# Altium schematic sheet AT86RF.SchDoc
size A3; DocumentNumber: 7; Revision: B; SheetNumber: 7; SheetTotal: 7; SheetTitle: Modem and TCXO; Designer: DM; Reviewer: -
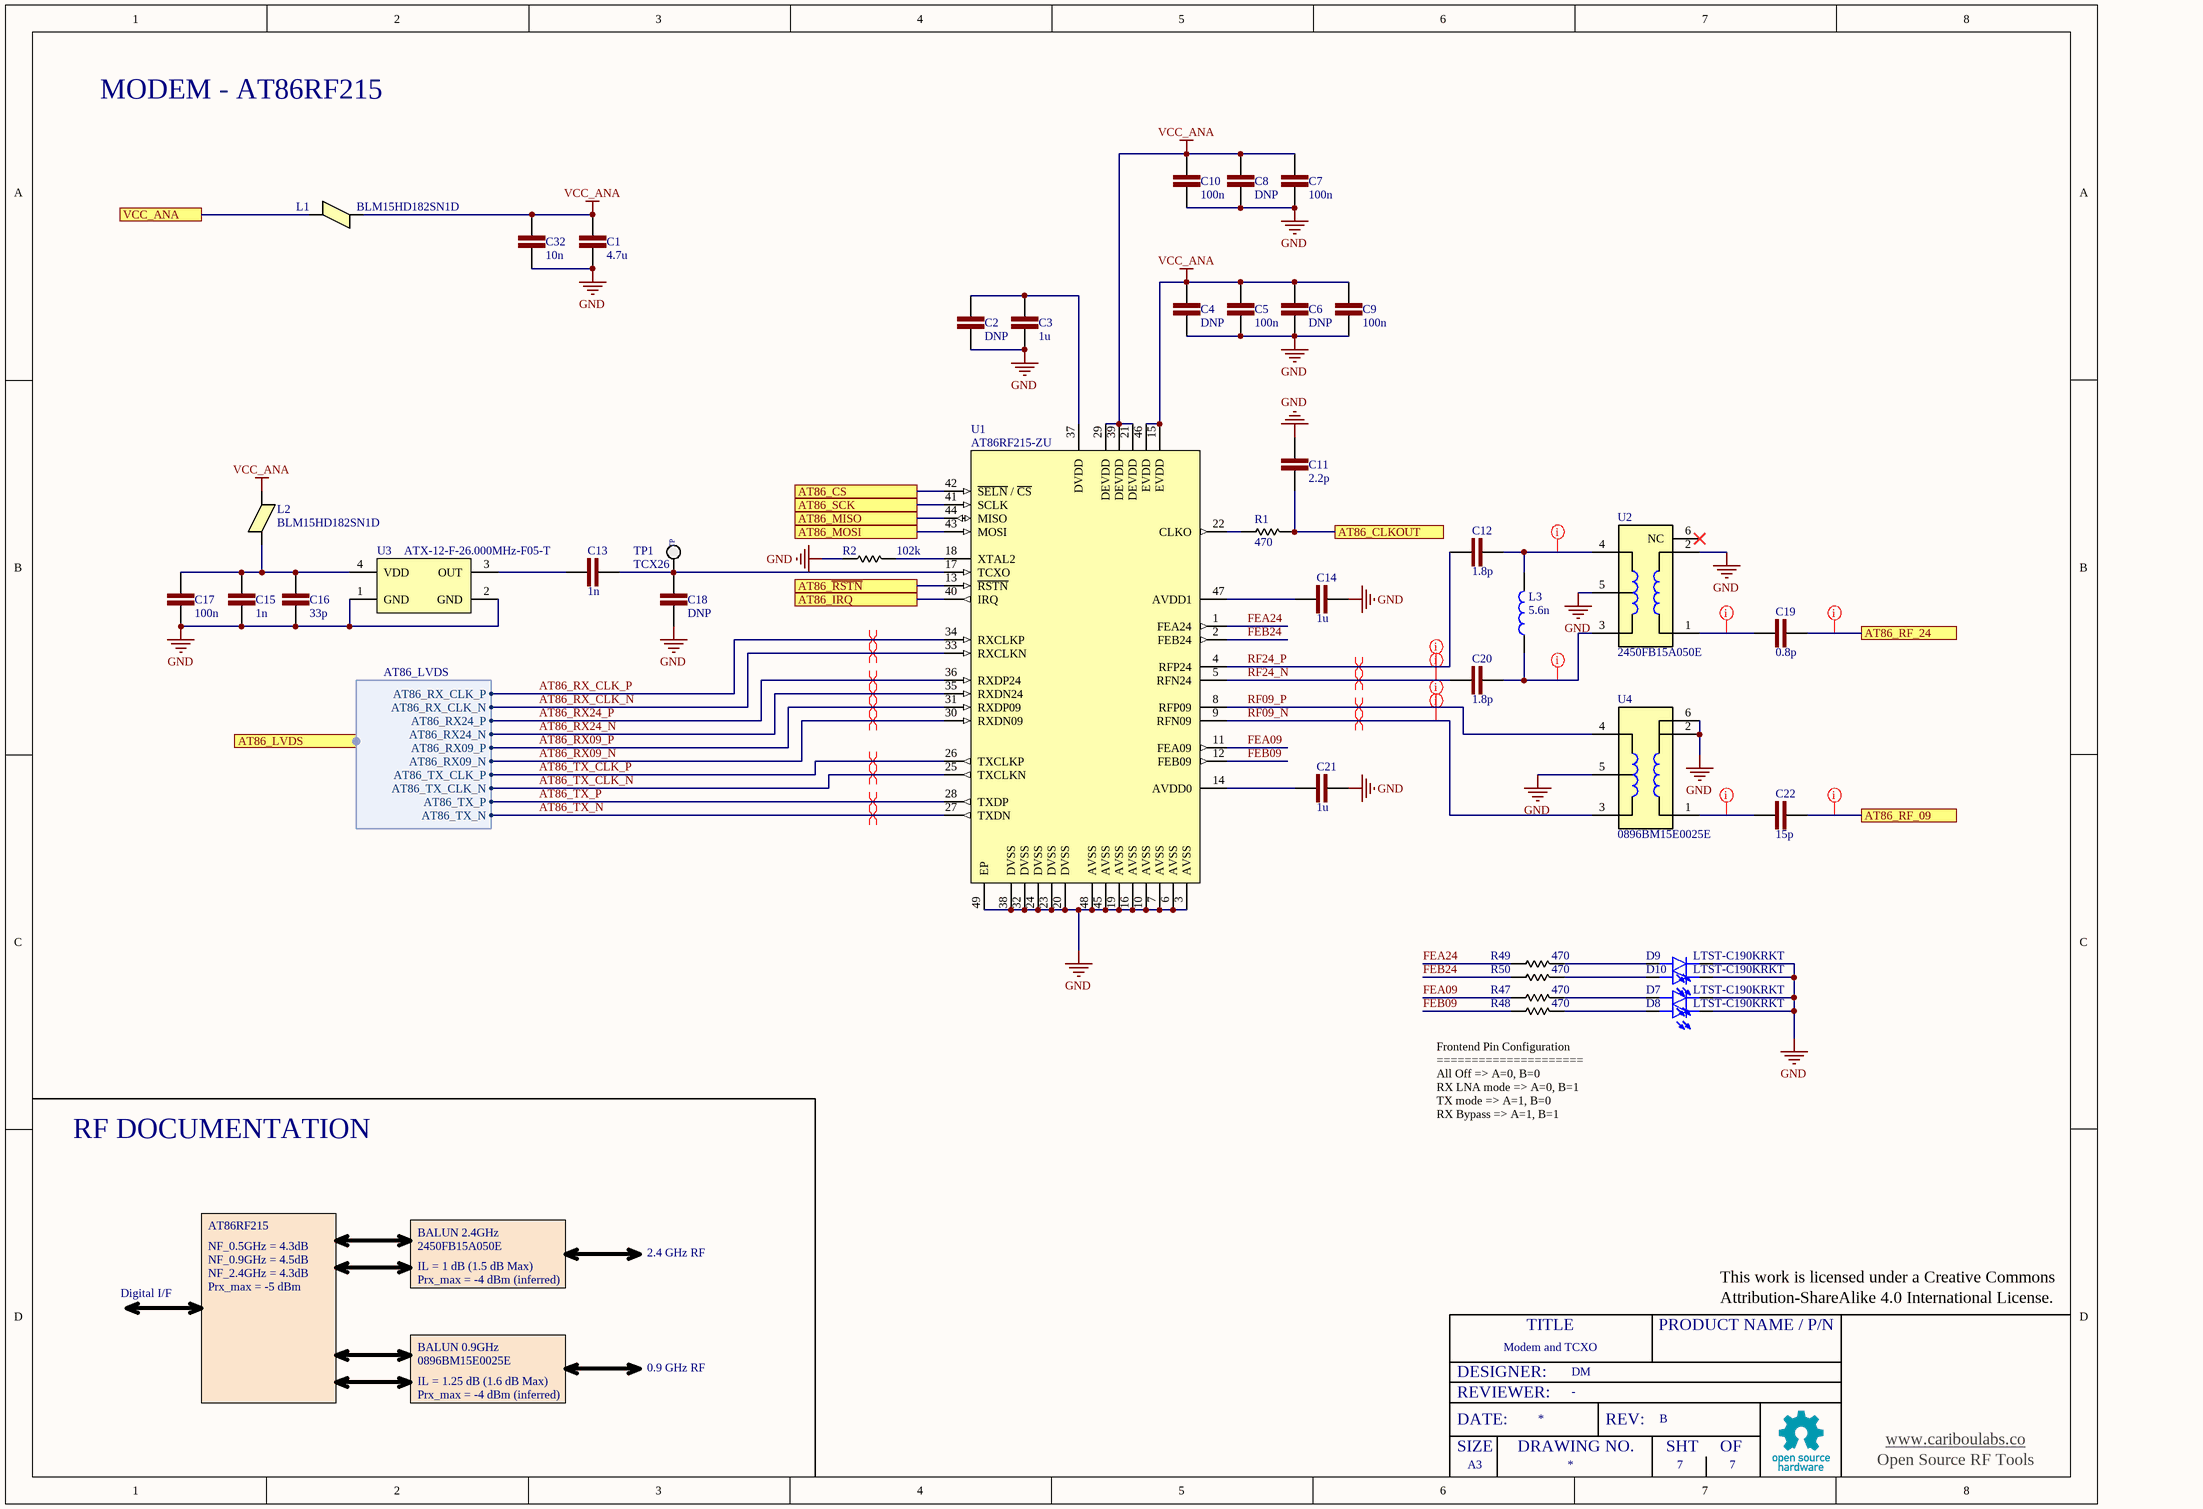
[diagram p0: AT86RF.SchDoc]

## Parts
C1  4.7u  [MURATA 0402]
C2  DNP  [MURATA 0402]
C3  1u  [MURATA 0402]
C4  DNP  [MURATA 0402]
C5  100n  [MURATA 0402]
C6  DNP  [MURATA 0402]
C7  100n  [MURATA 0402]
C8  DNP  [MURATA 0402]
C9  100n  [MURATA 0402]
C10  100n  [MURATA 0402]
C11  2.2p  [MURATA 0402]
C12  1.8p  [MURATA 0402]
C13  1n  [MURATA 0402]
C14  1u  [MURATA 0402]
C15  1n  [MURATA 0402]
C16  33p  [MURATA 0402]
C17  100n  [MURATA 0402]
C18  DNP  [MURATA 0402]
C19  0.8p  [MURATA 0402]
C20  1.8p  [MURATA 0402]
C21  1u  [MURATA 0402]
C22  15p  [MURATA 0402]
C32  10n  [MURATA 0402]
D7  LTST-C190KRKT  [LEDC1608X35N]
D8  LTST-C190KRKT  [LEDC1608X35N]
D9  LTST-C190KRKT  [LEDC1608X35N]
D10  LTST-C190KRKT  [LEDC1608X35N]
L1  BLM15HD182SN1D  [0402 FERRITE BEAD]
L2  BLM15HD182SN1D  [0402 FERRITE BEAD]
L3  5.6n  [CoilCraft 0402]
R1  470  [PANASONIC 0402]
R2  102k  [PANASONIC 0402]
R47  470  [PANASONIC 0402]
R48  470  [PANASONIC 0402]
R49  470  [PANASONIC 0402]
R50  470  [PANASONIC 0402]
TP1  TCX26  [TP_40]
U1  AT86RF215-ZU  [QFN50P700X700X90-49N-D]
U2  2450FB15A050E  [FIL_0896BM15E0025E]
U3  ATX-12-F-26.000MHz-F05-T  [TCXO_4_25x20]
U4  0896BM15E0025E  [FIL_0896BM15E0025E]

## Ports
AT86_CLKOUT, AT86_CS, AT86_IRQ, AT86_LVDS (harness AT86_LVDS), AT86_MISO, AT86_MOSI, AT86_RF_09, AT86_RF_24, AT86_SCK, AT86_~{RSTN}, VCC_ANA

## Harnesses
AT86_LVDS: AT86_RX_CLK_P, AT86_RX_CLK_N, AT86_RX24_P, AT86_RX24_N, AT86_RX09_P, AT86_RX09_N, AT86_TX_CLK_P, AT86_TX_CLK_N, AT86_TX_P, AT86_TX_N

## Nets
GND: C1.2 C2.1 C3.2 C4.1 C5.1 C6.1 C7.1 C8.1 C9.1 C10.1 C11.1 C14.1 C15.1 C16.1 C17.1 C18.1 C21.1 C32.2 D7.C D8.C D9.C D10.C R2.1 U1.3(AVSS) U1.6(AVSS) U1.7(AVSS) U1.10(AVSS) U1.16(AVSS) U1.19(AVSS) U1.20(DVSS) U1.23(DVSS) U1.24(DVSS) U1.32(DVSS) U1.38(DVSS) U1.45(AVSS) U1.48(AVSS) U1.49(EP) U2.2(GND) U2.5(GND) U3.1(GND) U3.2(GND) U4.2(GND) U4.5(GND) U4.6(GND)
VCC_ANA: C1.1 C4.2 C5.2 C6.2 C7.2 C8.2 C9.2 C10.2 C32.1 L1.2 L2.2 U1.15(EVDD) U1.21(DEVDD) U1.29(DEVDD) U1.39(DEVDD) U1.46(EVDD)
AT86_CLKOUT: C11.2 R1.2 ; port AT86_CLKOUT
AT86_CS: U1.42(~{SELN}_/_~{CS}) ; port AT86_CS
AT86_IRQ: U1.40(IRQ) ; port AT86_IRQ
AT86_MISO: U1.44(MISO) ; port AT86_MISO
AT86_MOSI: U1.43(MOSI) ; port AT86_MOSI
AT86_~{RSTN}: U1.13(~{RSTN}) ; port AT86_~{RSTN}
AT86_RF_09: C22.1 ; port AT86_RF_09
AT86_RF_24: C19.1 ; port AT86_RF_24
AT86_RX09_N: U1.30(RXDN09) ; port AT86_LVDS.AT86_RX09_N
AT86_RX09_P: U1.31(RXDP09) ; port AT86_LVDS.AT86_RX09_P
AT86_RX24_N: U1.35(RXDN24) ; port AT86_LVDS.AT86_RX24_N
AT86_RX24_P: U1.36(RXDP24) ; port AT86_LVDS.AT86_RX24_P
AT86_RX_CLK_N: U1.33(RXCLKN) ; port AT86_LVDS.AT86_RX_CLK_N
AT86_RX_CLK_P: U1.34(RXCLKP) ; port AT86_LVDS.AT86_RX_CLK_P
AT86_SCK: U1.41(SCLK) ; port AT86_SCK
AT86_TX_CLK_N: U1.25(TXCLKN) ; port AT86_LVDS.AT86_TX_CLK_N
AT86_TX_CLK_P: U1.26(TXCLKP) ; port AT86_LVDS.AT86_TX_CLK_P
AT86_TX_N: U1.27(TXDN) ; port AT86_LVDS.AT86_TX_N
AT86_TX_P: U1.28(TXDP) ; port AT86_LVDS.AT86_TX_P
FEA09: R47.1 U1.11(FEA09)
FEA24: R49.1 U1.1(FEA24)
FEB09: R48.1 U1.12(FEB09)
FEB24: R50.1 U1.2(FEB24)
RF09_N: U1.9(RFN09) U4.3(B1)
RF09_P: U1.8(RFP09) U4.4(B2)
RF24_N: C20.2 U1.5(RFN24)
RF24_P: C12.2 U1.4(RFP24)
VCC_ANA: L1.1 ; port VCC_ANA  [a separate net that carries the same name]
NetC2_2: C2.2 C3.1 U1.37(DVDD)
NetC12_1: C12.1 L3.2 U2.4(B2)
NetC13_1: C13.1 C18.2 TP1.1(TP) U1.17(TCXO)
NetC13_2: C13.2 U3.3(OUT)
NetC14_2: C14.2 U1.47(AVDD1)
NetC15_2: C15.2 C16.2 C17.2 L2.1 U3.4(VDD)
NetC19_2: C19.2 U2.1(UB)
NetC20_1: C20.1 L3.1 U2.3(B1)
NetC21_2: C21.2 U1.14(AVDD0)
NetC22_2: C22.2 U4.1(UB)
NetD7_A: D7.A R47.2
NetD8_A: D8.A R48.2
NetD9_A: D9.A R49.2
NetD10_A: D10.A R50.2
NetR1_1: R1.1 U1.22(CLKO)
NetR2_2: R2.2 U1.18(XTAL2)

Not connected (* = marked no-connect by the designer): U2 6(NC)*

## Layout directives
differential pair: AT86_RX09_N, AT86_RX09_P, AT86_RX24_N, AT86_RX24_P, AT86_RX_CLK_N, AT86_RX_CLK_P, AT86_TX_CLK_N, AT86_TX_CLK_P, AT86_TX_N, AT86_TX_P, RF09_N, RF09_P, RF24_N, RF24_P
net class RF50OHM: AT86_RF_09, AT86_RF_24, NetC12_1, NetC19_2, NetC20_1, NetC22_2, RF09_N, RF09_P, RF24_N, RF24_P

## Notes on the sheet
- MODEM - AT86RF215
- Frontend Pin Configuration
  =====================
  All Off => A=0, B=0
  RX LNA mode => A=0, B=1
  TX mode => A=1, B=0
  RX Bypass => A=1, B=1
- RF DOCUMENTATION
- AT86RF215
- NF_0.5GHz = 4.3dB
- NF_0.9GHz = 4.5dB
- BALUN 2.4GHz
- 2450FB15A050E
- 2.4 GHz RF
- Digital I/F
- NF_2.4GHz = 4.3dB
- Prx_max = -5 dBm
- IL = 1 dB (1.5 dB Max)
- Prx_max = -4 dBm (inferred)
- This work is licensed under a Creative Commons
- Attribution-ShareAlike 4.0 International License.
- BALUN 0.9GHz
- 0896BM15E0025E
- IL = 1.25 dB (1.6 dB Max)
- 0.9 GHz RF
- DESIGNER:
- REVIEWER:
- TITLE
- PRODUCT NAME / P/N
- SIZE
- DATE:
- DRAWING NO.
- REV:
- SHT
- OF
- www.cariboulabs.co
- A3
- Open Source RF Tools

## Library data of the parts
C1 = Capacitor: Multilayer Ceramic Capacitors MLCC - SMD/SMT 0402 MLCC X5R 4.7 uF +/ -20% 10V; Tolerance: 20%; Manu. P/N: GRJ155R61A475ME11J; Temp. Range: [-55, 85]; SRF: TBD [GHz]; Initial Voltage: 0; Vmax: 10V; Technology: X5R; VALUE: 4.7u
C2 = Capacitor: Tolerance: 5%; Vmax: 10V; Temp. Range: [-40, 125]; SRF: TBD [GHz]; Initial Voltage: 0; Manu. P/N: DNP; Technology: C0G; VALUE: DNP
C3 = Capacitor: Multilayer Ceramic Capacitors MLCC - SMD/SMT 0402 10VDC 1uF 20% X5R; Vmax: 10V; Manu. P/N: LMK105BJ105MVHF; Temp. Range: [-55, 85]; SRF: TBD [GHz]; Initial Voltage: 0; Tolerance: 20%; Technology: X5R; VALUE: 1u
C4 C6 C8 C18 = Capacitor: Capacitor - dc block; Tolerance: 5%; Vmax: 10V; Temp. Range: [-40, 125]; SRF: TBD [GHz]; Initial Voltage: 0; Manu. P/N: DNP; Technology: C0G; VALUE: DNP
C5 C7 C9 C10 C17 = Capacitor: Multilayer Ceramic Capacitors MLCC - SMD/SMT 16V .1uF X5R 0402 10%; Manu. P/N: 0402YD104KAT2A; Temp. Range: [-55, 85]; SRF: TBD [GHz]; Initial Voltage: 0; Tolerance: 10%; Vmax: 16V; Technology: X5R; VALUE: 100n
C11 = Capacitor: Multilayer Ceramic Capacitors MLCC - SMD/SMT, 0402 2.2pF +-0.1% 50V; Tolerance: 0.1%; Manu. P/N: 0402N2R2B500CT; Temp. Range: [-55, 125]; SRF: TBD [GHz]; Initial Voltage: 0; Vmax: 50V; Technology: C0G; VALUE: 2.2p
C12 C20 = Capacitor: Multilayer Ceramic Capacitors MLCC - SMD/SMT, 0402 1.8pF +-0.1% 50V; Tolerance: 5%; Manu. P/N: 0402N1R8B500CT; Temp. Range: [-55, 125]; SRF: TBD [GHz]; Initial Voltage: 0; Vmax: 50V; Technology: C0G; VALUE: 1.8p
C13 C15 = Capacitor: Multilayer Ceramic Capacitors MLCC 1000pF ±5% 100V C0G 0402; Manu. P/N: GRM1555C2A102JE01D; Temp. Range: [-40, 125]; SRF: TBD [GHz]; Initial Voltage: 0; Tolerance: 5%; Vmax: 100V; Technology: C0G; VALUE: 1n
C14 C21 = Capacitor: Multilayer Ceramic Capacitors MLCC - SMD/SMT 0402 10VDC 1uF 20% X5R; Tolerance: 5%; Vmax: 10V; Manu. P/N: LMK105BJ105MVHF; Temp. Range: [-55, 85]; SRF: TBD [GHz]; Initial Voltage: 0; Technology: X5R; VALUE: 1u
C16 = Capacitor: Multilayer Ceramic Capacitors MLCC - SMD/SMT 0402 50V 33pF C0G 0402 5%; Manu. P/N: C0402C330J5GAC; Temp. Range: [-55, 125]; SRF: TBD [GHz]; Initial Voltage: 0; Tolerance: 5%; Vmax: 50V; Technology: C0G; VALUE: 33p
C19 = Capacitor: Multilayer Ceramic Capacitors MLCC - SMD/SMT 0402 0pF 50volts C0G, 0.8pF; Alternative_MPN_Low_Price: 0402N0R8A500CT; Tolerance: 0.05pF; Vmax: 50V; Manu. P/N: GCM1555C1HR80WA16D; Temp. Range: [-55, 125]; SRF: TBD [GHz]; Initial Voltage: 0; Technology: C0G; VALUE: 0.8p
C22 = Capacitor: Multilayer Ceramic Capacitors MLCC - SMD/SMT 0402 15pF 50volts, C0G; Tolerance: 5%; Vmax: 50V; Manu. P/N: 0402N150J500CT; Temp. Range: [-55, 125]; SRF: TBD [GHz]; Initial Voltage: 0; Technology: C0G; VALUE: 15p
C32 = Capacitor: Multilayer Ceramic Capacitors MLCC - SMD/SMT 0402, 0.01UF 25V C0G; Tolerance: 5%; Manu. P/N: GRM1555C1E103JE01J; Temp. Range: [-55, 125]; SRF: TBD [GHz]; Initial Voltage: 0; Vmax: 25V; Technology: C0G; VALUE: 10n
D7-D10 = LTST-C190KRKT: Red 631nm LED Indication - Discrete 2V 0603; Manu. P/N: LTST-C190KRKT
L1 L2 = BLM15: Ferrite Beads 1800ohms GHz HiSpd; Imax: 0.2 A; Max DC Resistance: 2.2 Ohms; Temp. Range: [-40, 125]; Tolerance: 25%; Impedance @ 100 MHz: 1800 Ohms; Manu. P/N: BLM15HD182SN1D
L3 = Inductor: Fixed Inductors 1005 5.6nH Unshld 2% 760mA 83mOhms; Manu. P/N: 0402CS-5N6XGLW; SRF: TBD [GHz]; Tolerance: 2%; DC Imax: 760mA; DC Rmax: 83mOhms; VALUE: 5.6n
R1 R47-R50 = Resistor: Thick Film Resistors - SMD 1/16watt 470ohms 1%; Manu. P/N: CRCW0402470RFKED; Power Rating: 62.5 mW (1/16 W); Temp. Ceoff.: 100 PPM / C; Tolerance: 1%; VALUE: 470
R2 = Resistor: Thick Film Resistors - SMD 102 kOhms 62.5mW 0402 1%; Manu. P/N: RC0402FR-07102KL; Power Rating: 62.5 mW (1/16 W); Temp. Ceoff.: 100 PPM / C; Tolerance: 1%; VALUE: 102k
TP1 = TEST_POINT
U1 = AT86RF215-ZU: RF Transceiver Dual Band IEEE 802.15.4 TRX, 48QFN; Height: 0.9mm; Manu. P/N: AT86RF215-ZU
U2 = 2450FB15A050E: 2.45 GHz EIA 0805 Balun / Filter Combination 50 / 50Ohm 0805 (2012 Metric); Manu. P/N: 2450FB15A050E
U3 = ATX-12-F-26.000MHz-F05-T: TCXO Oscillators XTAL OSC TCXO 26 MHz Clipped Sinewave 0.5ppm -40C +85C 2.5x2mm, 1.6-3.6V; Value: 26 MHz; Manu. P/N: ATX-12-F-26.000MHz-F05-T
U4 = 0896BM15E0025E: RF Balun 863MHz ~ 928MHz 50 / 50Ohm 0805 (2012 Metric); Manu. P/N: 0896BM15E0025E